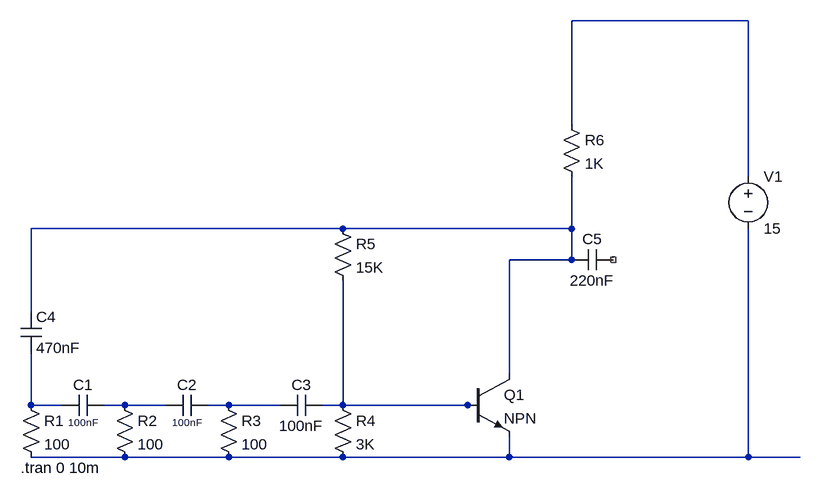
[diagram p0: schematic RC Oscillator Circuit.asc]
RC Oscillator Circuit.asc, the LTspice schematic file:
Version 4.1
SHEET 1 1172 680
WIRE 1088 -384 816 -384
WIRE 816 -224 816 -384
WIRE 1088 -144 1088 -384
WIRE 464 -64 -16 -64
WIRE 816 -64 816 -144
WIRE 816 -64 464 -64
WIRE 816 -16 816 -64
WIRE 816 -16 720 -16
WIRE -16 64 -16 -64
WIRE 720 160 720 -16
WIRE -16 208 -16 128
WIRE 32 208 -16 208
WIRE 128 208 96 208
WIRE 192 208 128 208
WIRE 288 208 256 208
WIRE 368 208 288 208
WIRE 464 208 464 16
WIRE 464 208 432 208
WIRE 656 208 464 208
WIRE 672 208 656 208
WIRE 128 288 -16 288
WIRE 288 288 128 288
WIRE 464 288 288 288
WIRE 720 288 720 256
WIRE 720 288 464 288
WIRE 1088 288 1088 -64
WIRE 1088 288 720 288
WIRE 1168 288 1088 288
SYMBOL res -32 192 R0
SYMATTR InstName R1
SYMATTR Value 100
SYMBOL res 112 192 R0
SYMATTR InstName R2
SYMATTR Value 100
SYMBOL res 272 192 R0
SYMATTR InstName R3
SYMATTR Value 100
SYMBOL res 448 192 R0
SYMATTR InstName R4
SYMATTR Value 3K
SYMBOL cap 96 192 R90
WINDOW 0 0 32 VBottom 2
WINDOW 3 32 32 VTop 1
SYMATTR InstName C1
SYMATTR Value 100nF
SYMBOL cap 256 192 R90
WINDOW 0 0 32 VBottom 2
WINDOW 3 32 32 VTop 1
SYMATTR InstName C2
SYMATTR Value 100nF
SYMBOL cap 432 192 R90
WINDOW 0 0 32 VBottom 2
WINDOW 3 32 32 VTop 2
SYMATTR InstName C3
SYMATTR Value 100nF
SYMBOL cap -32 64 R0
SYMATTR InstName C4
SYMATTR Value 470nF
SYMBOL res 448 -80 R0
SYMATTR InstName R5
SYMATTR Value 15K
SYMBOL npn 656 160 R0
SYMATTR InstName Q1
SYMBOL cap 880 -32 R90
WINDOW 0 0 32 VBottom 2
WINDOW 3 32 32 VTop 2
SYMATTR InstName C5
SYMATTR Value 220nF
SYMBOL res 800 -240 R0
SYMATTR InstName R6
SYMATTR Value 1K
SYMBOL voltage 1088 -160 R0
WINDOW 123 0 0 Left 0
WINDOW 39 0 0 Left 0
SYMATTR InstName V1
SYMATTR Value 15
TEXT -32 304 Left 2 !.tran 0 10m

The netlist it stands for:
* RC Oscillator Circuit.asc
R1 N003 N007 100
R2 N004 N007 100
R3 N005 N007 100
R4 N006 N007 3K
C1 N004 N003 100nF
C2 N005 N004 100nF
C3 N006 N005 100nF
C4 N002 N003 470nF
R5 N002 N006 15K
Q1 N002 N006 N007 0 NPN
C5 NC_01 N002 220nF
R6 N001 N002 1K
V1 N001 N007 15
.model NPN NPN
.model PNP PNP
.lib standard.bjt
.tran 0 10m
.backanno
.end